# EAGLE schematic inputsheild_3 (EAGLE 9.3.0)
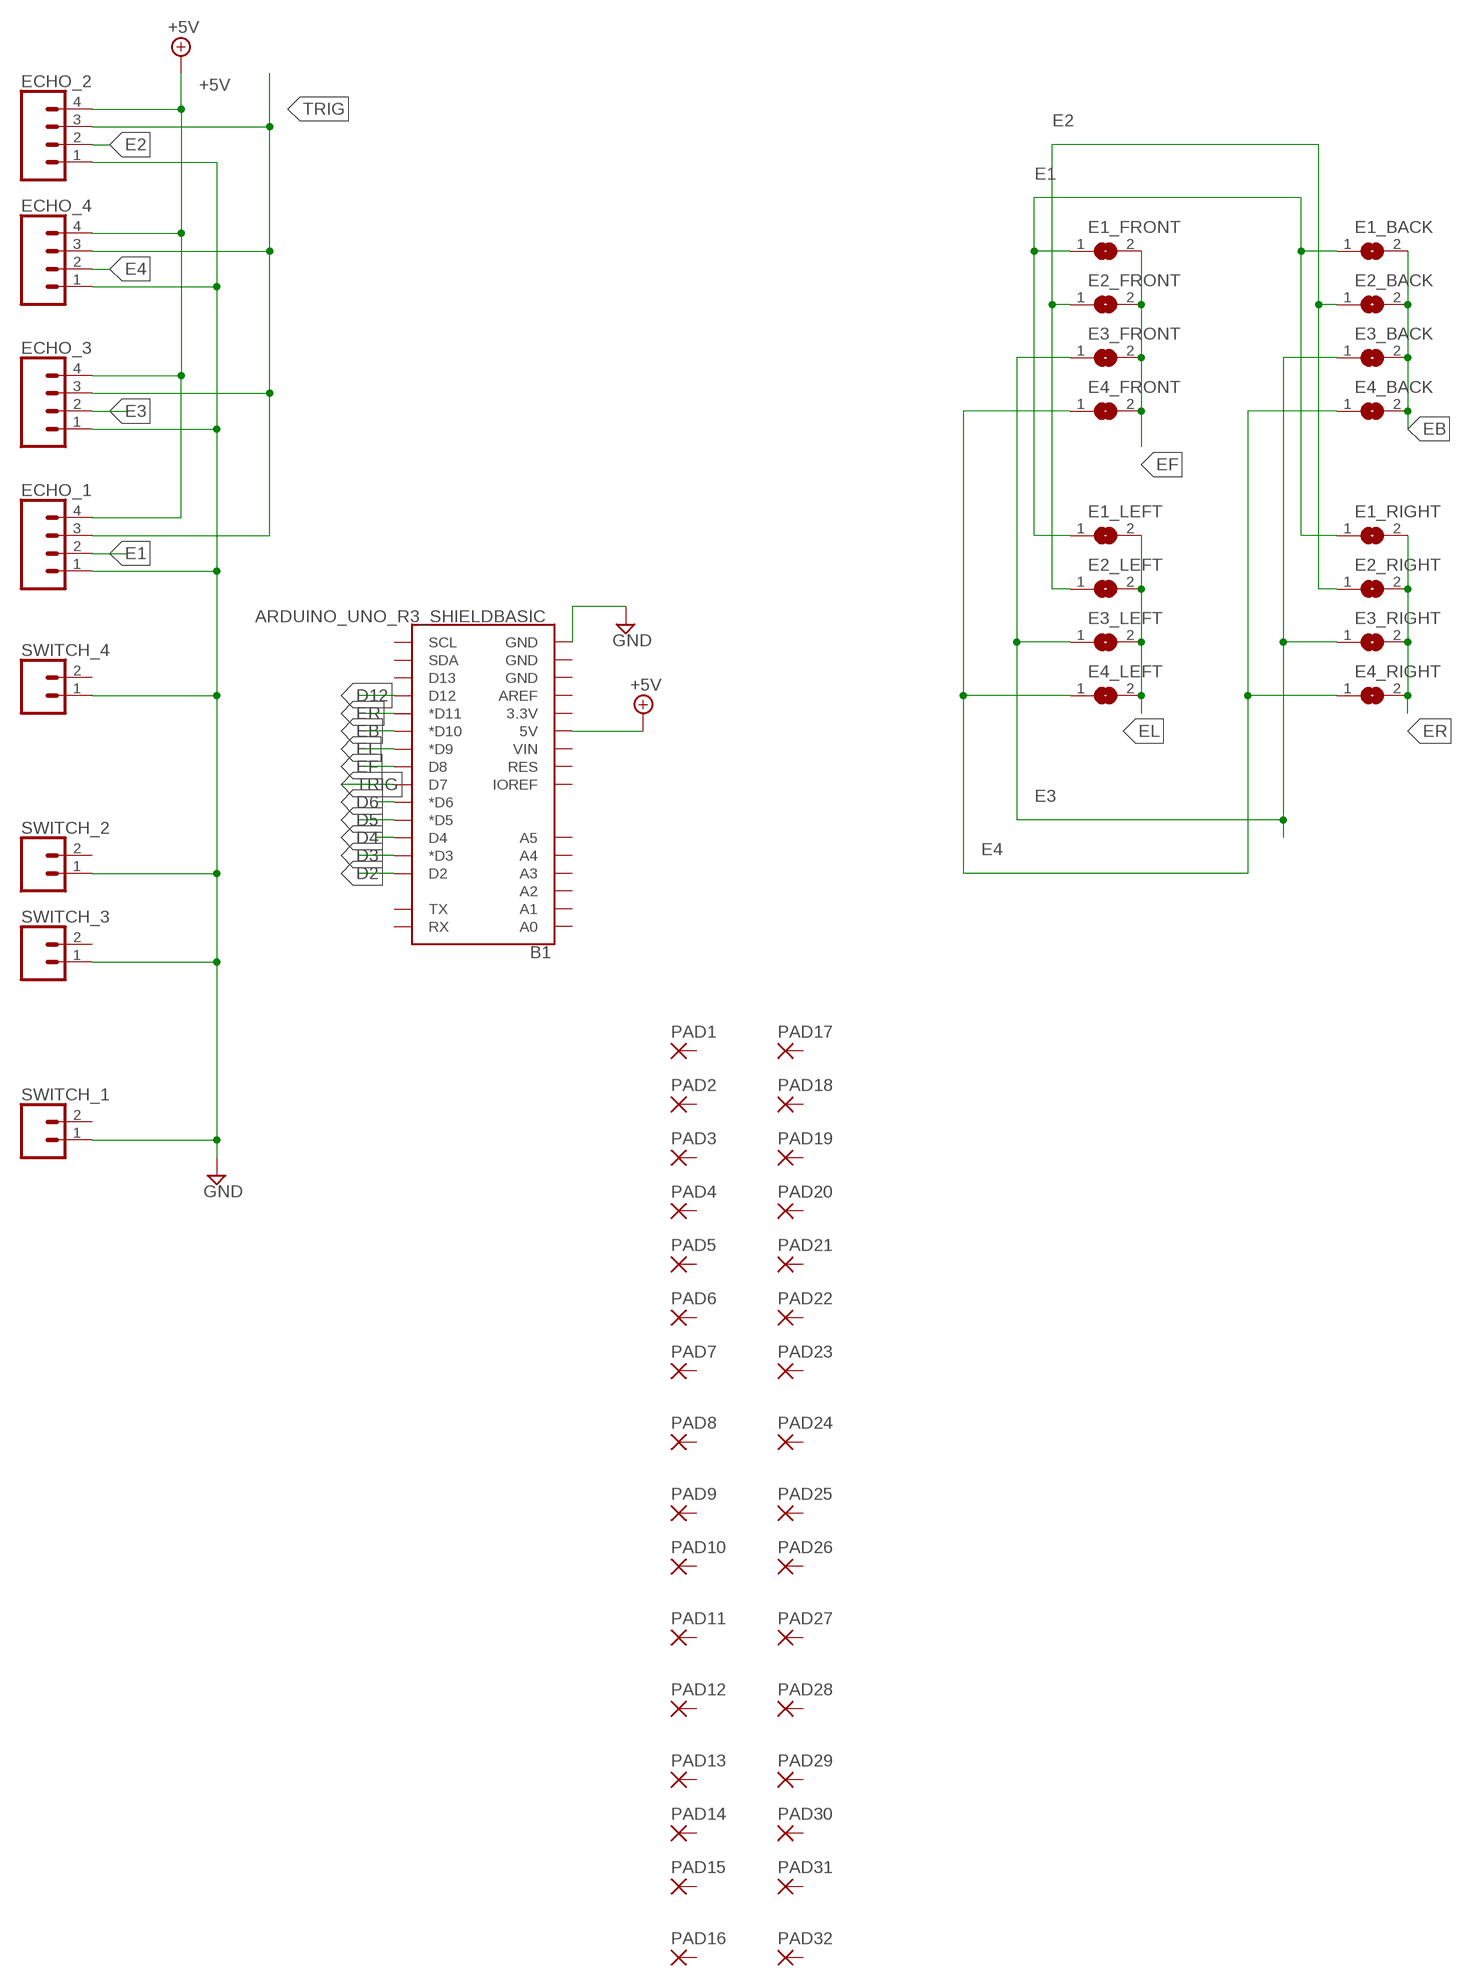
[diagram p0: schematic, sheet 1]

## Parts
B1  ARDUINO_UNO_R3_SHIELDBASIC  [UNO_R3_SHIELD]
E1_BACK  SJ  [SJ]
E1_FRONT  SJ  [SJ]
E1_LEFT  SJ  [SJ]
E1_RIGHT  SJ  [SJ]
E2_BACK  SJ  [SJ]
E2_FRONT  SJ  [SJ]
E2_LEFT  SJ  [SJ]
E2_RIGHT  SJ  [SJ]
E3_BACK  SJ  [SJ]
E3_FRONT  SJ  [SJ]
E3_LEFT  SJ  [SJ]
E3_RIGHT  SJ  [SJ]
E4_BACK  SJ  [SJ]
E4_FRONT  SJ  [SJ]
E4_LEFT  SJ  [SJ]
E4_RIGHT  SJ  [SJ]
ECHO_1  CONN_04SCREW  [SCREWTERMINAL-3.5MM-4]
ECHO_2  CONN_04SCREW  [SCREWTERMINAL-3.5MM-4]
ECHO_3  CONN_04SCREW  [SCREWTERMINAL-3.5MM-4]
ECHO_4  CONN_04SCREW  [SCREWTERMINAL-3.5MM-4]
PAD1  SMD5  [SMD2,54-5,08]
PAD2  SMD5  [SMD2,54-5,08]
PAD3  SMD5  [SMD2,54-5,08]
PAD4  SMD5  [SMD2,54-5,08]
PAD5  SMD5  [SMD2,54-5,08]
PAD6  SMD5  [SMD2,54-5,08]
PAD7  SMD5  [SMD2,54-5,08]
PAD8  SMD5  [SMD2,54-5,08]
PAD9  SMD5  [SMD2,54-5,08]
PAD10  SMD5  [SMD2,54-5,08]
PAD11  SMD5  [SMD2,54-5,08]
PAD12  SMD5  [SMD2,54-5,08]
PAD13  SMD5  [SMD2,54-5,08]
PAD14  SMD5  [SMD2,54-5,08]
PAD15  SMD5  [SMD2,54-5,08]
PAD16  SMD5  [SMD2,54-5,08]
PAD17  SMD5  [SMD2,54-5,08]
PAD18  SMD5  [SMD2,54-5,08]
PAD19  SMD5  [SMD2,54-5,08]
PAD20  SMD5  [SMD2,54-5,08]
PAD21  SMD5  [SMD2,54-5,08]
PAD22  SMD5  [SMD2,54-5,08]
PAD23  SMD5  [SMD2,54-5,08]
PAD24  SMD5  [SMD2,54-5,08]
PAD25  SMD5  [SMD2,54-5,08]
PAD26  SMD5  [SMD2,54-5,08]
PAD27  SMD5  [SMD2,54-5,08]
PAD28  SMD5  [SMD2,54-5,08]
PAD29  SMD5  [SMD2,54-5,08]
PAD30  SMD5  [SMD2,54-5,08]
PAD31  SMD5  [SMD2,54-5,08]
PAD32  SMD5  [SMD2,54-5,08]
SWITCH_1  CONN_023.5MM  [SCREWTERMINAL-3.5MM-2]
SWITCH_2  CONN_023.5MM  [SCREWTERMINAL-3.5MM-2]
SWITCH_3  CONN_023.5MM  [SCREWTERMINAL-3.5MM-2]
SWITCH_4  CONN_023.5MM  [SCREWTERMINAL-3.5MM-2]

## Nets
+5V: B1.5V ECHO_1.4 ECHO_2.4 ECHO_3.4 ECHO_4.4
D2: B1.D2
D3: B1.D3(*D3)
D4: B1.D4
D5: B1.D5(*D5)
D6: B1.D6(*D6)
D12: B1.D12
E1: E1_BACK.1 E1_FRONT.1 E1_LEFT.1 E1_RIGHT.1 ECHO_1.2
E2: E2_BACK.1 E2_FRONT.1 E2_LEFT.1 E2_RIGHT.1 ECHO_2.2
E3: E3_BACK.1 E3_FRONT.1 E3_LEFT.1 E3_RIGHT.1 ECHO_3.2
E4: E4_BACK.1 E4_FRONT.1 E4_LEFT.1 E4_RIGHT.1 ECHO_4.2
EB: B1.D10(*D10) E1_BACK.2 E2_BACK.2 E3_BACK.2 E4_BACK.2
EF: B1.D8 E1_FRONT.2 E2_FRONT.2 E3_FRONT.2 E4_FRONT.2
EL: B1.D9(*D9) E1_LEFT.2 E2_LEFT.2 E3_LEFT.2 E4_LEFT.2
ER: B1.D11(*D11) E1_RIGHT.2 E2_RIGHT.2 E3_RIGHT.2 E4_RIGHT.2
GND: B1.GND@0(GND) ECHO_1.1 ECHO_2.1 ECHO_3.1 ECHO_4.1 SWITCH_1.1 SWITCH_2.1 SWITCH_3.1 SWITCH_4.1
TRIG: B1.D7 ECHO_1.3 ECHO_2.3 ECHO_3.3 ECHO_4.3
Unconnected: B1.3.3V B1.A0 B1.A1 B1.A2 B1.A3 B1.A4 B1.A5 B1.AREF B1.D13 B1.GND@1(GND) B1.GND@2(GND) B1.IOREF B1.RES B1.RX B1.SCL B1.SDA B1.TX B1.VIN PAD1.1(P) PAD2.1(P) PAD3.1(P) PAD4.1(P) PAD5.1(P) PAD6.1(P) PAD7.1(P) PAD8.1(P) PAD9.1(P) PAD10.1(P) PAD11.1(P) PAD12.1(P) PAD13.1(P) PAD14.1(P) PAD15.1(P) PAD16.1(P) PAD17.1(P) PAD18.1(P) PAD19.1(P) PAD20.1(P) PAD21.1(P) PAD22.1(P) PAD23.1(P) PAD24.1(P) PAD25.1(P) PAD26.1(P) PAD27.1(P) PAD28.1(P) PAD29.1(P) PAD30.1(P) PAD31.1(P) PAD32.1(P) SWITCH_1.2 SWITCH_2.2 SWITCH_3.2 SWITCH_4.2

## Library data of the parts
B1 = SparkFun-Boards:ARDUINO_UNO_R3_SHIELD: Arduino R3 Shield Footprint Shield form compatible with the Arduino Uno R3. SparkFun Products: MG2639 Cellular Shield <https://www.sparkfun.com/products/13120> MIDI Shield <https://www.sparkfun.com/products/12898> R3 Stackable Headers Kit <https://www.sparkfun.com/products/11417>
E1_BACK E1_FRONT E1_LEFT E1_RIGHT E2_BACK E2_FRONT E2_LEFT E2_RIGHT E3_BACK E3_FRONT E3_LEFT E3_RIGHT E4_BACK E4_FRONT E4_LEFT E4_RIGHT = jumper:SJ: SMD solder JUMPER
ECHO_1-ECHO_4 = SparkFun-Connectors:CONN_04: Multi connection point. Often used as Generic Header-pin footprint for 0.1 inch spaced/style header connections On any of the 0.1 inch spaced packages, you can populate with these: Break Away Headers - Straight <https://www.sparkfun.com/products/116> (PRT-00116) Break Away Male Headers - Right Angle <https://www.sparkfun.com/products/553> (PRT-00553) Female Headers <https://www.sparkfun.com/products/115> (PRT-00115) Break Away Headers - Machine Pin <https://www.sparkfun.com/products/117> (PRT-00117) Break Away Female Headers - Swiss Machine Pin <https://www.sparkfun.com/products/743> (PRT-00743) For SCREWTERMINALS and SPRING TERMINALS visit here: Screw Terimnals on SparkFun.com <https://www.sparkfun.com/search/results?term=Screw+Terminals> (5mm/3.5mm/2.54mm spacing) This device is also useful as a general connection point to wire up your design to another part of your project. Our various solder wires solder well into these plated through hole pads. Hook-Up Wire - Assortment (Stranded, 22 AWG) <https://www.sparkfun.com/products/11375> (PRT-11375) Hook-Up Wire - Assortment (Solid Core, 22 AWG) <https://www.sparkfun.com/products/11367> (PRT-11367) View the entire wire category on our website here <https://www.sparkfun.com/categories/141> Special notes: Molex polarized connector foot print use with SKU : PRT-08231 with associated crimp pins and housings. 1MM SMD Version SKU: PRT-10208; PROD_ID: 2xCONN-08399; SF_ID: 2xPRT-08084
PAD1-PAD32 = wirepad:SMD5: SMD PAD
SWITCH_1-SWITCH_4 = SparkFun-Connectors:CONN_02: Multi connection point. Often used as Generic Header-pin footprint for 0.1 inch spaced/style header connections On any of the 0.1 inch spaced packages, you can populate with these: Break Away Headers - Straight <https://www.sparkfun.com/products/116> (PRT-00116) Break Away Male Headers - Right Angle <https://www.sparkfun.com/products/553> (PRT-00553) Female Headers <https://www.sparkfun.com/products/115> (PRT-00115) Break Away Headers - Machine Pin <https://www.sparkfun.com/products/117> (PRT-00117) Break Away Female Headers - Swiss Machine Pin <https://www.sparkfun.com/products/743> (PRT-00743) For SCREWTERMINALS and SPRING TERMINALS visit here: Screw Terimnals on SparkFun.com <https://www.sparkfun.com/search/results?term=Screw+Terminals> (5mm/3.5mm/2.54mm spacing) This device is also useful as a general connection point to wire up your design to another part of your project. Our various solder wires solder well into these plated through hole pads. Hook-Up Wire - Assortment (Stranded, 22 AWG) <https://www.sparkfun.com/products/11375> (PRT-11375) Hook-Up Wire - Assortment (Solid Core, 22 AWG) <https://www.sparkfun.com/products/11367> (PRT-11367) View the entire wire category on our website here <https://www.sparkfun.com/categories/141> Special notes: Molex polarized connector foot print use with: PRT-08233 with associated crimp pins and housings. 2.54_SCREWTERM for use with PRT-10571. 3.5mm Screw Terminal footprints for PRT-08084 5mm Screw Terminal footprints for use with PRT-08432; PROD_ID: CONN-08399